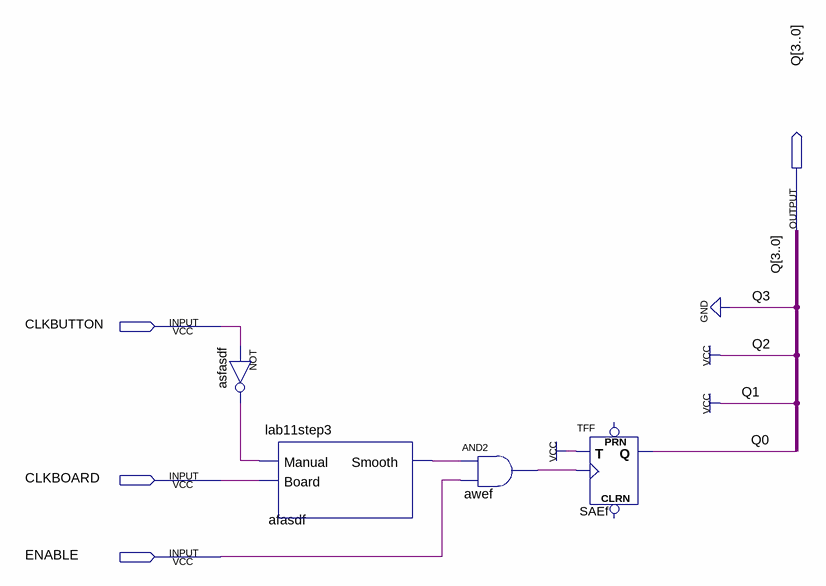
[diagram p0: schematic sheet]
// Quartus schematic mod2counter67.bdf as structural Verilog: 4 symbols, 4 pins
module mod2counter67 (
  input  CLKBUTTON,
  input  CLKBOARD,
  input  ENABLE,
  output [3:0] Q
);

  wire afasdf_smooth, asfasdf_out, awef_out;

  not asfasdf (asfasdf_out, CLKBUTTON);
  lab11step3 afasdf (.Manual(asfasdf_out), .Board(CLKBOARD), .Smooth(afasdf_smooth));
  and awef (awef_out, afasdf_smooth, ENABLE);
  TFF SAEf (.T(1'b1), .CLK(awef_out), .Q(Q[0]));  // open: PRN, CLRN

  assign Q[3:1] = 3'b011;
endmodule
